# Altium schematic sheet [13] - ETHERNET PHY.SchDoc
size A2; DocumentNumber: 13; SheetNumber: 13; SheetTotal: 20
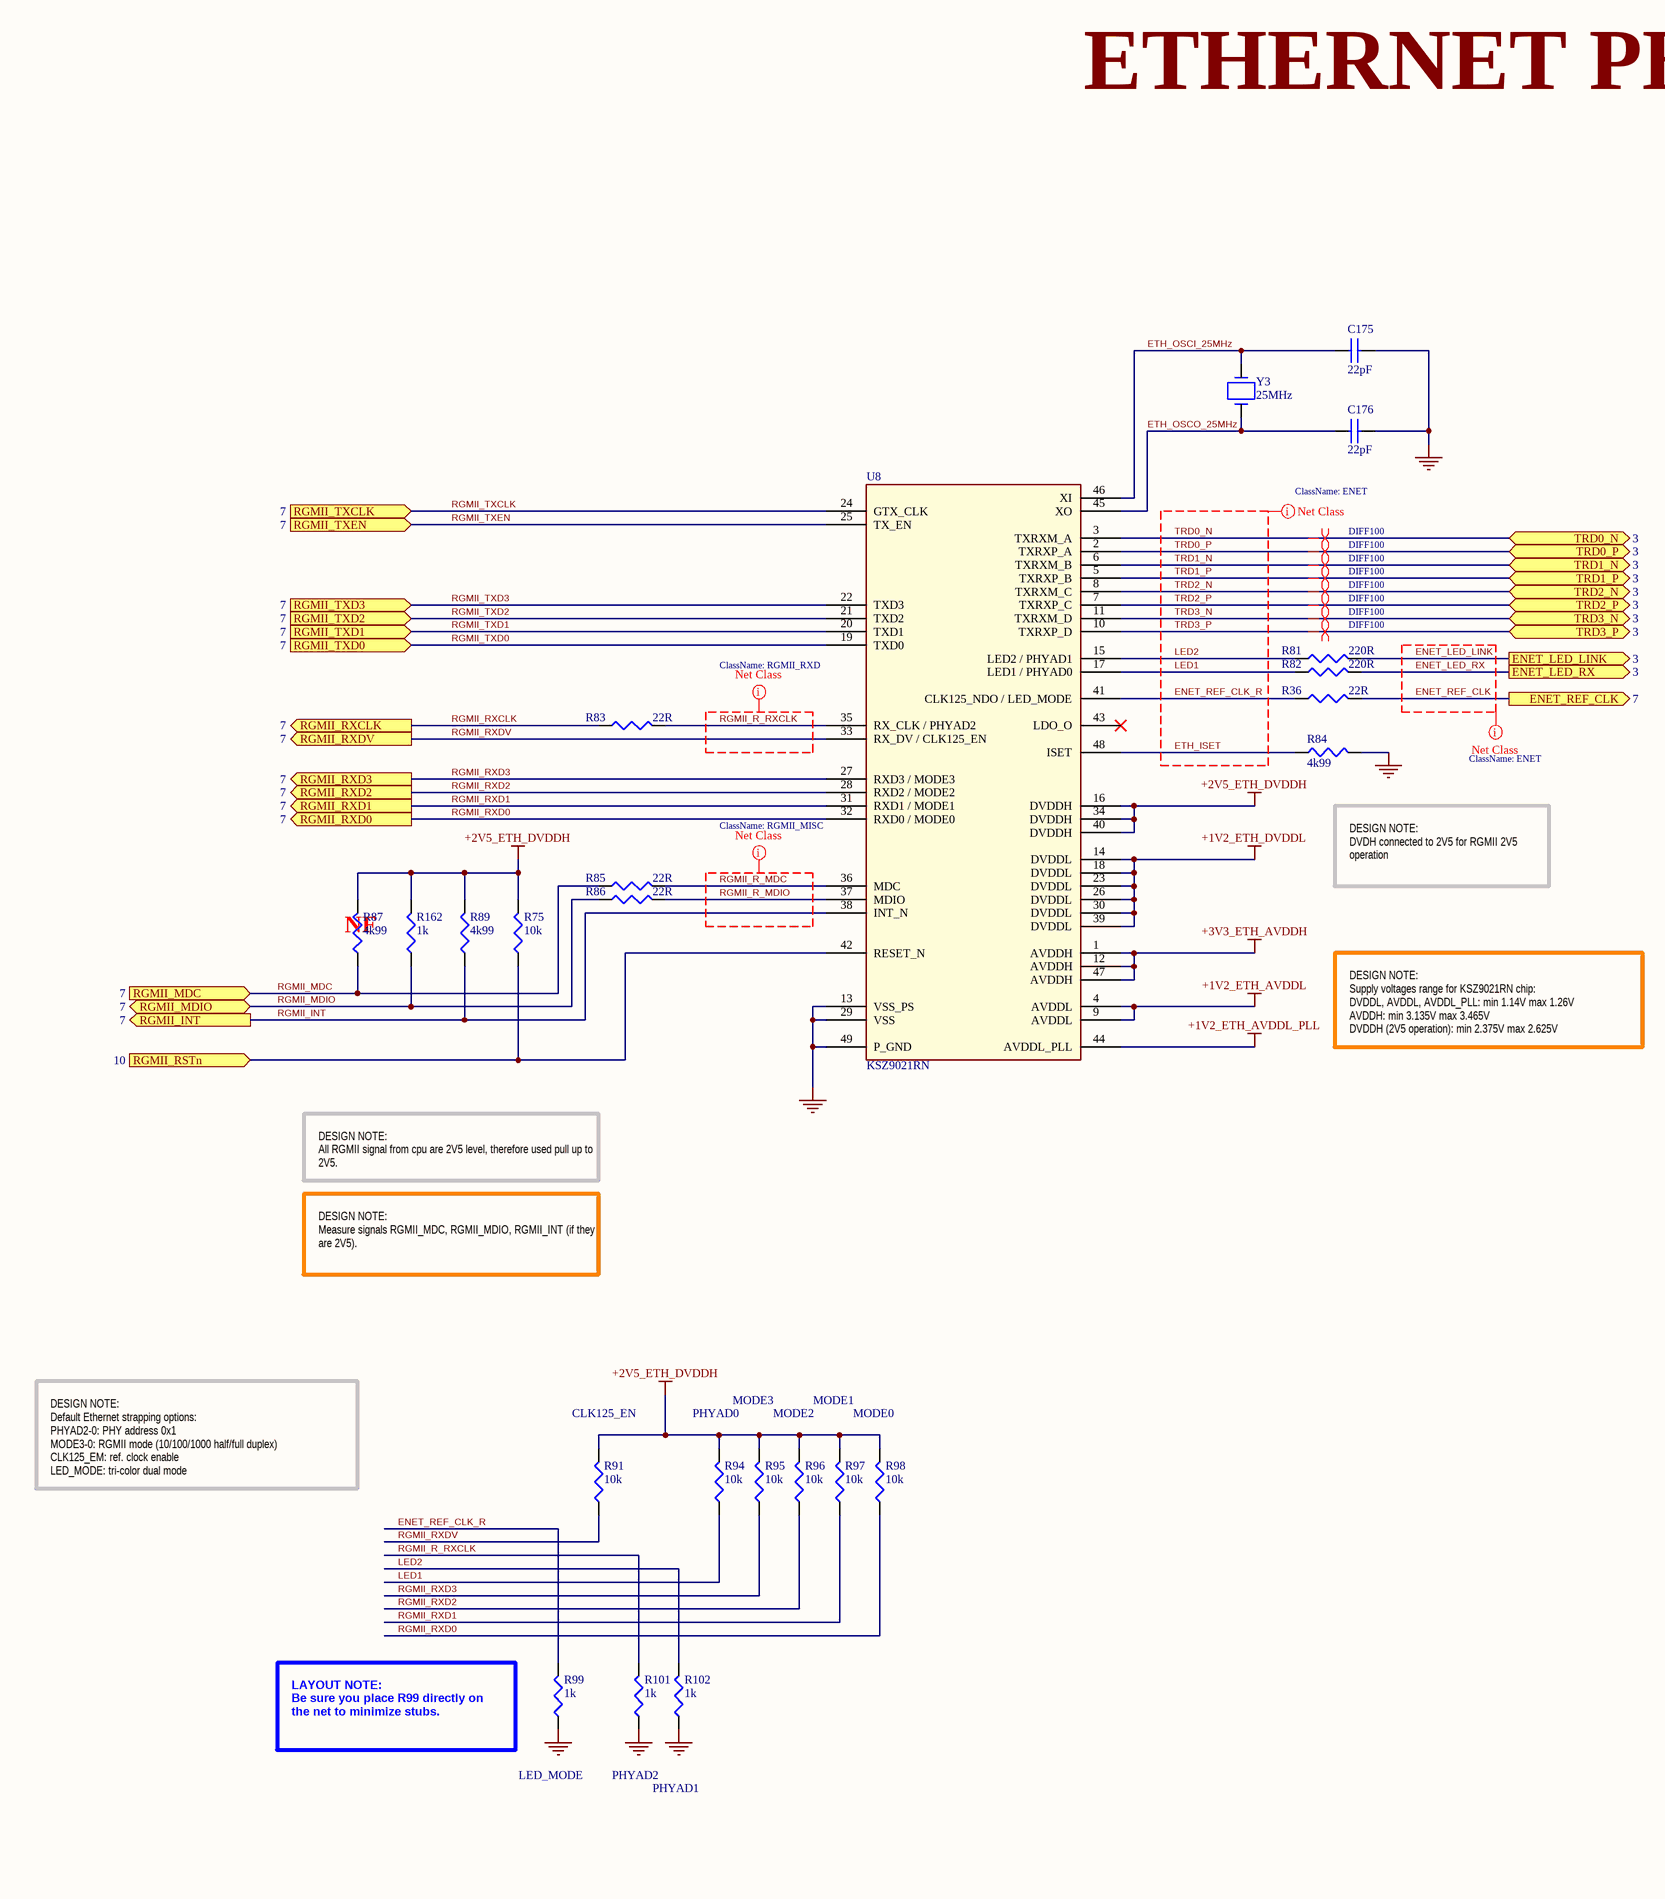
[diagram p0: [13] - ETHERNET PHY.SchDoc, left]
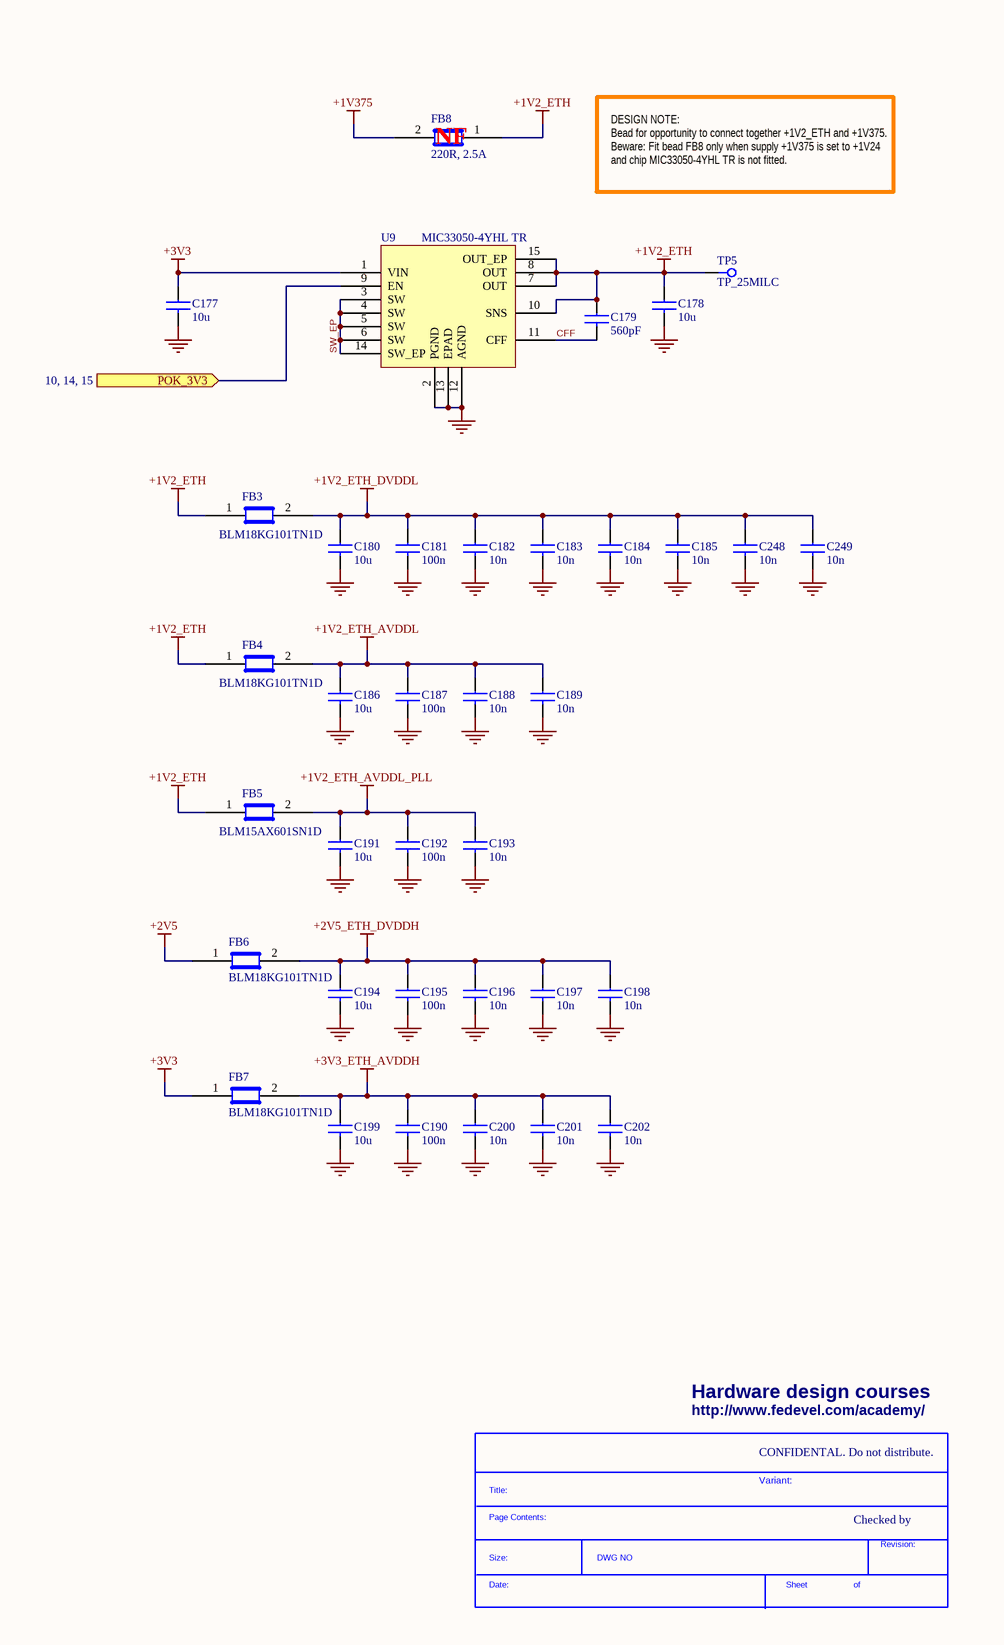
[diagram p1: [13] - ETHERNET PHY.SchDoc, right]

## Parts
*  SDTitleBlock  (value not drawn)  (graphical)
C175  22pF  [C0402]
C176  22pF  [C0402]
C177  10u  [C0603]
C178  10u  [C0603]
C179  560pF  [C0402]
C180  10u  [C0603]
C181  100n  [C0402]
C182  10n  [C0402]
C183  10n  [C0402]
C184  10n  [C0402]
C185  10n  [C0402]
C186  10u  [C0603]
C187  100n  [C0402]
C188  10n  [C0402]
C189  10n  [C0402]
C190  100n  [C0402]
C191  10u  [C0603]
C192  100n  [C0402]
C193  10n  [C0402]
C194  10u  [C0603]
C195  100n  [C0402]
C196  10n  [C0402]
C197  10n  [C0402]
C198  10n  [C0402]
C199  10u  [C0603]
C200  10n  [C0402]
C201  10n  [C0402]
C202  10n  [C0402]
C248  10n  [C0402]
C249  10n  [C0402]
FB3  BLM18KG101TN1D  [C0603]
FB4  BLM18KG101TN1D  [C0603]
FB5  BLM15AX601SN1D  [C0402]
FB6  BLM18KG101TN1D  [C0603]
FB7  BLM18KG101TN1D  [C0603]
FB8  220R, 2.5A  [C0603]
R36  22R  [R0402]
R75  10k  [R0402]
R81  220R  [R0402]
R82  220R  [R0402]
R83  22R  [R0402]
R84  4k99  [R0402]
R85  22R  [R0402]
R86  22R  [R0402]
R87  4k99  [R0402]
R89  4k99  [R0402]
R91  10k  [R0402]
R94  10k  [R0402]
R95  10k  [R0402]
R96  10k  [R0402]
R97  10k  [R0402]
R98  10k  [R0402]
R99  1k  [R0402]
R101  1k  [R0402]
R102  1k  [R0402]
R162  1k  [R0402]
TP5  TP_25MILC  [TP_25C]  (no BOM)
U8  KSZ9021RN  [QFN48_7MMX7MM]
U9  MIC33050-4YHL TR  [MLF_3x3_12PINS]
Y3  25MHz  [ABM7_v1_1]

## Ports
ENET_LED_LINK (out, see 3), ENET_LED_RX (out, see 3), ENET_REF_CLK (out, see 7), POK_3V3 (see 10, 14, 15), RGMII_INT (out, see 7), RGMII_MDC (in, see 7), RGMII_MDIO (bidir, see 7), RGMII_RSTn (in, see 10), RGMII_RXCLK (out, see 7), RGMII_RXD0 (out, see 7), RGMII_RXD1 (out, see 7), RGMII_RXD2 (out, see 7), RGMII_RXD3 (out, see 7), RGMII_RXDV (out, see 7), RGMII_TXCLK (in, see 7), RGMII_TXD0 (in, see 7), RGMII_TXD1 (in, see 7), RGMII_TXD2 (in, see 7), RGMII_TXD3 (in, see 7), RGMII_TXEN (in, see 7), TRD0_N (bidir, see 3), TRD0_P (bidir, see 3), TRD1_N (bidir, see 3), TRD1_P (bidir, see 3), TRD2_N (bidir, see 3), TRD2_P (bidir, see 3), TRD3_N (bidir, see 3), TRD3_P (bidir, see 3)

## Nets
+1V2_ETH: C178.1 C179.1 FB3.1 FB4.1 FB5.1 FB8.1 TP5.1 U9.7(OUT) U9.8(OUT) U9.10(SNS) U9.15(OUT_EP)
+1V2_ETH_AVDDL: C186.1 C187.1 C188.1 C189.1 FB4.2 U8.4(AVDDL) U8.9(AVDDL)
+1V2_ETH_AVDDL_PLL: C191.1 C192.1 C193.1 FB5.2 U8.44(AVDDL_PLL)
+1V2_ETH_DVDDL: C180.1 C181.1 C182.1 C183.1 C184.1 C185.1 C248.1 C249.1 FB3.2 U8.14(DVDDL) U8.18(DVDDL) U8.23(DVDDL) U8.26(DVDDL) U8.30(DVDDL) U8.39(DVDDL)
+1V375: FB8.2
+2V5: FB6.1
+2V5_ETH_DVDDH: C194.1 C195.1 C196.1 C197.1 C198.1 FB6.2 R75.2 R87.2 R89.2 R91.2 R94.2 R95.2 R96.2 R97.2 R98.2 R162.2 U8.16(DVDDH) U8.34(DVDDH) U8.40(DVDDH)
+3V3: C177.1 FB7.1 U9.1(VIN)
+3V3_ETH_AVDDH: C190.1 C199.1 C200.1 C201.1 C202.1 FB7.2 U8.1(AVDDH) U8.12(AVDDH) U8.47(AVDDH)
GND: C175.2 C176.2 C177.2 C178.2 C180.2 C181.2 C182.2 C183.2 C184.2 C185.2 C186.2 C187.2 C188.2 C189.2 C190.2 C191.2 C192.2 C193.2 C194.2 C195.2 C196.2 C197.2 C198.2 C199.2 C200.2 C201.2 C202.2 C248.2 C249.2 R84.2 R99.1 R101.1 R102.1 U8.13(VSS_PS) U8.29(VSS) U8.49(P_GND) U9.2(PGND) U9.12(AGND) U9.13(EPAD)
CFF: C179.2 U9.11(CFF)
ENET_LED_LINK: R81.2 ; port ENET_LED_LINK
ENET_LED_RX: R82.2 ; port ENET_LED_RX
ENET_REF_CLK: R36.2 ; port ENET_REF_CLK
ENET_REF_CLK_R: R36.1 R99.2 U8.41(CLK125_NDO_/_LED_MODE)
ETH_ISET: R84.1 U8.48(ISET)
ETH_OSCI_25MHz: C175.1 U8.46(XI) Y3.2
ETH_OSCO_25MHz: C176.1 U8.45(XO) Y3.1
LED1: R82.1 R94.1 U8.17(LED1_/_PHYAD0)
LED2: R81.1 R102.2 U8.15(LED2_/_PHYAD1)
POK_3V3: U9.9(EN) ; port POK_3V3
RGMII_INT: R89.1 U8.38(INT_N) ; port RGMII_INT
RGMII_MDC: R85.1 R87.1 ; port RGMII_MDC
RGMII_MDIO: R86.1 R162.1 ; port RGMII_MDIO
RGMII_R_MDC: R85.2 U8.36(MDC)
RGMII_R_MDIO: R86.2 U8.37(MDIO)
RGMII_R_RXCLK: R83.2 R101.2 U8.35(RX_CLK_/_PHYAD2)
RGMII_RSTn: R75.1 U8.42(RESET_N) ; port RGMII_RSTn
RGMII_RXCLK: R83.1 ; port RGMII_RXCLK
RGMII_RXD0: R98.1 U8.32(RXD0_/_MODE0) ; port RGMII_RXD0
RGMII_RXD1: R97.1 U8.31(RXD1_/_MODE1) ; port RGMII_RXD1
RGMII_RXD2: R96.1 U8.28(RXD2_/_MODE2) ; port RGMII_RXD2
RGMII_RXD3: R95.1 U8.27(RXD3_/_MODE3) ; port RGMII_RXD3
RGMII_RXDV: R91.1 U8.33(RX_DV_/_CLK125_EN) ; port RGMII_RXDV
RGMII_TXCLK: U8.24(GTX_CLK) ; port RGMII_TXCLK
RGMII_TXD0: U8.19(TXD0) ; port RGMII_TXD0
RGMII_TXD1: U8.20(TXD1) ; port RGMII_TXD1
RGMII_TXD2: U8.21(TXD2) ; port RGMII_TXD2
RGMII_TXD3: U8.22(TXD3) ; port RGMII_TXD3
RGMII_TXEN: U8.25(TX_EN) ; port RGMII_TXEN
SW_EP: U9.3(SW) U9.4(SW) U9.5(SW) U9.6(SW) U9.14(SW_EP)
TRD0_N: U8.3(TXRXM_A) ; port TRD0_N
TRD0_P: U8.2(TXRXP_A) ; port TRD0_P
TRD1_N: U8.6(TXRXM_B) ; port TRD1_N
TRD1_P: U8.5(TXRXP_B) ; port TRD1_P
TRD2_N: U8.8(TXRXM_C) ; port TRD2_N
TRD2_P: U8.7(TXRXP_C) ; port TRD2_P
TRD3_N: U8.11(TXRXM_D) ; port TRD3_N
TRD3_P: U8.10(TXRXP_D) ; port TRD3_P

Not connected (* = marked no-connect by the designer): U8 43(LDO_O)*

## Layout directives
differential pair; net class DIFF100: TRD0_N, TRD0_P, TRD1_N, TRD1_P, TRD2_N, TRD2_P, TRD3_N, TRD3_P
net class ENET: ENET_LED_LINK, ENET_LED_RX, ENET_REF_CLK, ENET_REF_CLK_R, ETH_ISET, LED1, LED2, TRD0_N, TRD0_P, TRD1_N, TRD1_P, TRD2_N, TRD2_P, TRD3_N, TRD3_P
net class RGMII_MISC: RGMII_R_MDC, RGMII_R_MDIO
net class RGMII_RXD: RGMII_R_RXCLK

## Notes on the sheet
- ETHERNET PHY
- (near FB8) NF
- DESIGN NOTE:
  Bead for opportunity to connect together +1V2_ETH and +1V375. Beware: Fit bead FB8 only when supply +1V375 is set to +1V24 and chip MIC33050-4YHL TR is not fitted.
- DESIGN NOTE:
  DVDH connected to 2V5 for RGMII 2V5 operation
- (near R87) NF
- DESIGN NOTE:
  Supply voltages range for KSZ9021RN chip:
  DVDDL, AVDDL, AVDDL_PLL: min 1.14V max 1.26V
  AVDDH: min 3.135V max 3.465V
  DVDDH (2V5 operation): min 2.375V max 2.625V
- DESIGN NOTE:
  All RGMII signal from cpu are 2V5 level, therefore used pull up to 2V5.
- DESIGN NOTE:
  Measure signals RGMII_MDC, RGMII_MDIO, RGMII_INT (if they are 2V5).
- (near R91) CLK125_EN
- PHYAD0
- MODE3
- MODE2
- MODE1
- MODE0
- DESIGN NOTE:
  Default Ethernet strapping options:
  PHYAD2-0: PHY address 0x1
  MODE3-0: RGMII mode (10/100/1000 half/full duplex)
  CLK125_EM: ref. clock enable
  LED_MODE: tri-color dual mode
- LAYOUT NOTE:
  Be sure you place R99 directly on the net to minimize stubs.
- LED_MODE
- PHYAD2
- Hardware design courses
- PHYAD1
- http://www.fedevel.com/academy/
- CONFIDENTAL. Do not distribute.
- Variant:
- Checked by
- (in symbol SDTitleBlock) Title:; Page Contents:; Revision:; Size:; DWG NO; Date:; Sheet; of

## Library data of the parts
C175 C176 = C1005C0G1H220J: CAP CER 22PF 50V C0G 5% 0402; Manufacturer: TDK Corporation; .Checked PCB: used; Description: CAP CER 22PF 50V 5% NP0 0402; Temperature Coefficient: C0G, NP0; Capacitance: 22pF; Category: Capacitors; Manufacturer Part Number: C1005C0G1H220J; Operating Temperature: -55°C ~ 125°C; Package / Case: 0402 (1005 Metric); Price 1k [$]: 0.00442; Value: 22pF; .Checked SCH: used; Voltage - Rated: 50V; Supplier Part Number: 445-1239-1-ND; Supplier: Digikey; Supplier 1: Digi-Key; Supplier Part Number 1: 445-1239-1-ND; RoHS: RoHS Compliant; Stock 1: 176261; Pricing 1: 1=0.08, 10=0.05, 100=0.018, 250=0.013, 500=0.0096, 1000=0.0065 (USD); Tolerance: ±5%; Mounting Type: Surface Mount, MLCC; Applications: General Purpose; Ratings: -; Size / Dimension: 0.039" L x 0.020" W (1.00mm x 0.50mm); Height - Seated (Max): -; Thickness (Max): 0.022" (0.55mm); Lead Spacing: -; Features: -; Packaging: Cut Tape (CT); Lead Style: -; ComponentLink1URL: http://www.tdk.co.jp/tefe02/e412_c.pdf; ComponentLink1Description: http://www.tdk.co.jp/tefe02/e412_c.pdf
C177 C178 C180 C186 C191 C194 C199 = C1608X5R0J106M: CAP CER 10UF 6.3V X5R 20% 0603; Manufacturer: TDK Corporation; Capacitance: 10µF; Value: 10µF; .Checked PCB: used; Description: CAP CER 10UF 6.3V 20% X5R 0603; Category: Capacitors; Manufacturer Part Number: C1608X5R0J106M; Operating Temperature: -55°C ~ 85°C; Package / Case: 0603 (1608 Metric); Price 1k [$]: 0.08580; .Checked SCH: used; Voltage - Rated: 6.3V; Features: Low ESR; Supplier Part Number: 445-4112-1-ND; Supplier: Digikey; Supplier 1: Digi-Key; Supplier Part Number 1: 445-4112-1-ND; RoHS: RoHS Compliant; Stock 1: 48157; Pricing 1: 1=0.46, 10=0.363, 100=0.1898, 250=0.14024, 500=0.1089, 1000=0.0858 (USD); Tolerance: ±20%; Temperature Coefficient: X5R; Mounting Type: Surface Mount, MLCC; Applications: General Purpose; Ratings: -; Size / Dimension: 0.063" L x 0.031" W (1.60mm x 0.80mm); Height - Seated (Max): -; Thickness (Max): 0.037" (0.95mm); Lead Spacing: -; Packaging: Cut Tape (CT); Lead Style: -; ComponentLink1URL: http://www.tdk.com/pdf/general_B11.pdf; ComponentLink1Description: http://www.tdk.com/pdf/general_B11.pdf
C179 = GRM1555C1H561JA01D: CAP CER 560PF 50V C0G 0402; Manufacturer: Murata Electronics North America; .Checked PCB: used; Description: CAP CER 560PF 50V 5% NP0 0402; Tolerance: ±5%; Temperature Coefficient: C0G, NP0; Capacitance: 560pF; Category: Capacitors; Supplier Part Number: 490-3238-1-ND; Manufacturer Part Number: GRM1555C1H561JA01D; Operating Temperature: -55°C ~ 125°C; Package / Case: 0402 (1005 Metric); Price 1k [$]: 0.0149; Value: 560pF; .Checked SCH: used; Voltage - Rated: 50V; Supplier: Digikey; Supplier 1: Digi-Key; Supplier Part Number 1: 490-3238-1-ND; RoHS: RoHS Compliant; Stock 1: 301161; Pricing 1: 10=0.066, 50=0.0528, 100=0.0396, 250=0.0286, 500=0.02112, 1000=0.0143, 5000=0.011 (USD); Mounting Type: Surface Mount, MLCC; Applications: General Purpose; Ratings: -; Size / Dimension: 0.039" L x 0.020" W (1.00mm x 0.50mm); Height - Seated (Max): -; Thickness (Max): 0.022" (0.55mm); Lead Spacing: -; Features: -; Packaging: Cut Tape (CT); Lead Style: -; ComponentLink1URL: http://search.murata.co.jp/Ceramy/image/img/PDF/ENG/GRM1555C1H561JA01.pdf; ComponentLink1Description: http://search.murata.co.jp/Ceramy/image/img/PDF/ENG/GRM1555C1H561JA01.pdf
C181 C187 C190 C192 C195 = C1005X5R1H104K: CAP CER .10UF 50V X5R 10% 0402; Manufacturer: TDK Corporation; Capacitance: 0.1µF; Value: 100nF; .Checked PCB: used; Description: CAP CER 0.1UF 50V 10% X5R 0402; Category: Capacitors; Manufacturer Part Number: C1005X5R1H104K; Operating Temperature: -55°C ~ 85°C; Package / Case: 0402 (1005 Metric); Price 1k [$]: 0.02340; .Checked SCH: used; Voltage - Rated: 50V; Supplier Part Number: 445-5942-1-ND; Supplier: Digikey; Supplier 1: Digi-Key; Supplier Part Number 1: 445-5942-1-ND; RoHS: RoHS Compliant; Stock 1: 106926; Pricing 1: 1=0.27, 10=0.18, 100=0.072, 250=0.05176, 500=0.0369, 1000=0.027 (USD); Tolerance: ±10%; Temperature Coefficient: X5R; Mounting Type: Surface Mount, MLCC; Applications: General Purpose; Ratings: -; Size / Dimension: 0.039" L x 0.020" W (1.00mm x 0.50mm); Height - Seated (Max): -; Thickness (Max): 0.022" (0.55mm); Lead Spacing: -; Features: -; Packaging: Cut Tape (CT); Lead Style: -; ComponentLink1URL: http://www.tdk.co.jp/tefe02/e412_c.pdf; ComponentLink1Description: http://www.tdk.co.jp/tefe02/e412_c.pdf
C182-C185 C188 C189 C193 C196-C198 C200-C202 C248 C249 = C1005X7R1C103K: CAP CER 10000PF 16V X7R 10% 0402; Manufacturer: TDK Corporation; Value: 10nF; .Checked PCB: used; Description: CAP CER 10000PF 16V 10% X7R 0402; Capacitance: 10000pF; Category: Capacitors; Manufacturer Part Number: C1005X7R1C103K; Operating Temperature: -55°C ~ 125°C; Package / Case: 0402 (1005 Metric); Price 1k [$]: 0.00416; .Checked SCH: used; Voltage - Rated: 16V; Supplier Part Number: 445-1262-1-ND; Supplier: Digikey; Supplier 1: Digi-Key; Supplier Part Number 1: 445-1262-1-ND; RoHS: RoHS Compliant; Stock 1: 511497; Pricing 1: 1=0.08, 10=0.05, 100=0.018, 250=0.013, 500=0.0096, 1000=0.0065 (USD); Tolerance: ±10%; Temperature Coefficient: X7R; Mounting Type: Surface Mount, MLCC; Applications: General Purpose; Ratings: -; Size / Dimension: 0.039" L x 0.020" W (1.00mm x 0.50mm); Height - Seated (Max): -; Thickness (Max): 0.022" (0.55mm); Lead Spacing: -; Features: -; Packaging: Cut Tape (CT); Lead Style: -; ComponentLink1URL: http://www.tdk.co.jp/tefe02/e412_c.pdf; ComponentLink1Description: http://www.tdk.co.jp/tefe02/e412_c.pdf
FB3 FB4 FB6 FB7 = BLM18KG101TN1D: FERRITE CHIP 100 OHM BEAD 0603 3A; Manufacturer: Murata Electronics North America; .Checked PCB: used; Impedance @ Frequency: 100 Ohm @ 100MHz; DC Resistance (DCR): 30 mOhm Max; Filter Type: Differential Mode - Single; Number of Lines: 1; .Checked SCH: used; Category: Filters; Manufacturer Part Number: BLM18KG101TN1D; Package / Case: 0603 (1608 Metric); Price 1k [$]: 0.04320; Value: BLM18KG101TN1D; Current Rating: 3A; Supplier Part Number: 490-5448-1-ND; Supplier: Digikey; Supplier 1: Digi-Key; Supplier Part Number 1: 490-5448-1-ND; RoHS: RoHS Compliant; Description: FERRITE CHIP 100 OHM BEAD 0603; Stock 1: 10314; Pricing 1: 1=0.35, 10=0.23, 50=0.1196, 100=0.0922, 250=0.06624, 500=0.04724, 1000=0.03456 (USD); Mounting Type: Surface Mount; Packaging: Cut Tape (CT); Height (Max): 0.030" (0.75mm); Size / Dimension: 0.063" L x 0.031" W (1.60mm x 0.80mm); ComponentLink1URL: http://search.murata.co.jp/Ceramy/image/img/PDF/ENG/L0110S0100BLM18K.pdf; ComponentLink1Description: http://search.murata.co.jp/Ceramy/image/img/PDF/ENG/L0110S0100BLM18K.pdf
FB5 = BLM15AX601SN1D: FERRITE CHIP 600 OHM 0402 420mA; Manufacturer: Murata Electronics North America; .Checked PCB: used; Impedance @ Frequency: 600 Ohm @ 100MHz; DC Resistance (DCR): 340 mOhm Max; Filter Type: Differential Mode - Single; Number of Lines: 1; .Checked SCH: used; Category: Filters; Manufacturer Part Number: BLM15AX601SN1D; Package / Case: 0402 (1005 Metric); Price 1k [$]: 0.03280; Value: BLM15AX601SN1D; Current Rating: 420mA; Supplier Part Number: 490-5441-1-ND; Supplier: Digikey; Supplier 1: Digi-Key; Supplier Part Number 1: 490-5441-1-ND; RoHS: RoHS Compliant; Description: FERRITE CHIP 600 OHM 0402; Stock 1: 34008; Pricing 1: 1=0.26, 10=0.197, 50=0.1148, 100=0.0918, 250=0.0656, 500=0.0446, 1000=0.03608, 5000=0.02821 (USD); Mounting Type: Surface Mount; Packaging: Cut Tape (CT); Height (Max): 0.022" (0.55mm); Size / Dimension: 0.039" L x 0.020" W (1.00mm x 0.50mm); ComponentLink1URL: http://search.murata.co.jp/Ceramy/image/img/PDF/ENG/L0110S0100BLM15AX_SN.pdf; ComponentLink1Description: http://search.murata.co.jp/Ceramy/image/img/PDF/ENG/L0110S0100BLM15AX_SN.pdf
FB8 = BLM18SG221TN1D: FERRITE CHIP 220 OHM 2500MA 0603; Manufacturer: Murata Electronics North America; Impedance @ Frequency: 220 Ohm @ 100MHz; DC Resistance (DCR): 40 mOhm Max; Filter Type: Differential Mode - Single; Number of Lines: 1; .Checked PCB: RF; Supplier 1: Digi-Key; Supplier Part Number 1: 490-5225-1-ND; Manufacturer Part Number: BLM18SG221TN1D; RoHS: RoHS Compliant; Category: Filters; Stock 1: 54640; Pricing 1: 1=0.38, 10=0.282, 50=0.1646, 100=0.1316, 250=0.094, 500=0.06392, 1000=0.0517, 5000=0.04042 (USD); Current Rating: 2.5A; Package / Case: 0603 (1608 Metric); Mounting Type: Surface Mount; Packaging: Cut Tape (CT); Height (Max): 0.037" (0.95mm); Size / Dimension: 0.063" L x 0.031" W (1.60mm x 0.80mm); ComponentLink1URL: http://search.murata.co.jp/Ceramy/image/img/PDF/ENG/L0110S0100BLM18S.pdf; ComponentLink1Description: http://search.murata.co.jp/Ceramy/image/img/PDF/ENG/L0110S0100BLM18S.pdf; .Checked SCH: RF
R36 R83 R85 R86 = RC0402FR-0722RL: RES 22.0 OHM 1/16W 1% 0402 SMD; Manufacturer: Yageo; Resistance (Ohms): 22; Power (Watts): 0.063W, 1/16W; .Checked PCB: used; Temperature Coefficient: ±100ppm/°C; Category: Resistors; Manufacturer Part Number: RC0402FR-0722RL; Package / Case: 0402 (1005 Metric); Price 1k [$]: 0.01421; Tolerance: ±1%; Value: 22R; .Checked SCH: used; Supplier Part Number: 311-22.0LRCT-ND; Supplier: Digikey; Supplier 1: Digi-Key; Supplier Part Number 1: 311-22.0LRCT-ND; RoHS: RoHS Compliant; Stock 1: 943800; Pricing 1: 10=0.014, 50=0.0104, 100=0.0079, 250=0.00584, 500=0.00432, 1000=0.00288 (USD); Composition: Thick Film; Features: -; Size / Dimension: 0.039" L x 0.020" W (1.00mm x 0.50mm); Height: 0.016" (0.40mm); Number of Terminations: 2; Packaging: Cut Tape (CT); ComponentLink1URL: http://www.yageo.com/documents/recent/PYu-RC0402_51_RoHS_L_6.pdf; ComponentLink1Description: http://www.yageo.com/documents/recent/PYu-RC0402_51_RoHS_L_6.pdf
R75 R91 R94-R98 = RC0402FR-0710KL: RES 10.0K OHM 1/16W 1% 0402 SMD; Manufacturer: Yageo; Power (Watts): 0.063W, 1/16W; .Checked PCB: used; Temperature Coefficient: ±100ppm/°C; Category: Resistors; Supplier Part Number: 311-10.0KLRCT-ND; Manufacturer Part Number: RC0402FR-0710KL; Package / Case: 0402 (1005 Metric); Price 1k [$]: 0.01421; Resistance (Ohms): 10K; Tolerance: ±1%; Value: 10k; .Checked SCH: used; Supplier: Digikey; Supplier 1: Digi-Key; Supplier Part Number 1: 311-10.0KLRCT-ND; RoHS: RoHS Compliant; Stock 1: 2916495; Pricing 1: 10=0.014, 50=0.0104, 100=0.0079, 250=0.00584, 500=0.00432, 1000=0.00288 (USD); Composition: Thick Film; Features: -; Size / Dimension: 0.039" L x 0.020" W (1.00mm x 0.50mm); Height: 0.016" (0.40mm); Number of Terminations: 2; Packaging: Cut Tape (CT); ComponentLink1URL: http://www.yageo.com/documents/recent/PYu-RC0402_51_RoHS_L_6.pdf; ComponentLink1Description: http://www.yageo.com/documents/recent/PYu-RC0402_51_RoHS_L_6.pdf
R81 R82 = RC0402FR-07220RL: RES 220 OHM 1/16W 1% 0402 SMD; Manufacturer: Yageo; Resistance (Ohms): 220; Power (Watts): 0.063W, 1/16W; .Checked PCB: used; Temperature Coefficient: ±100ppm/°C; Category: Resistors; Manufacturer Part Number: RC0402FR-07220RL; Package / Case: 0402 (1005 Metric); Price 1k [$]: 0.01421; Tolerance: ±1%; Value: 220R; .Checked SCH: used; Supplier Part Number: 311-220LRCT-ND; Supplier: Digikey; Supplier 1: Digi-Key; Supplier Part Number 1: 311-220LRCT-ND; RoHS: RoHS Compliant; Stock 1: 276463; Pricing 1: 10=0.014, 50=0.0104, 100=0.0079, 250=0.00584, 500=0.00432, 1000=0.00288 (USD); Composition: Thick Film; Features: -; Size / Dimension: 0.039" L x 0.020" W (1.00mm x 0.50mm); Height: 0.016" (0.40mm); Number of Terminations: 2; Packaging: Cut Tape (CT); ComponentLink1URL: http://www.yageo.com/documents/recent/PYu-RC0402_51_RoHS_L_6.pdf; ComponentLink1Description: http://www.yageo.com/documents/recent/PYu-RC0402_51_RoHS_L_6.pdf
R84 R87 R89 = RMCF0402FT4K99: RES TF 4.99K OHM 1% 1/16W 0402; Manufacturer: Stackpole Electronics Inc; Power (Watts): 0.063W, 1/16W; .Checked PCB: used; Temperature Coefficient: ±100ppm/°C; Category: Resistors; Manufacturer Part Number: RMCF0402FT4K99; Package / Case: 0402 (1005 Metric); Price 1k [$]: 0.00384; Resistance (Ohms): 4.99K; Tolerance: ±1%; Value: 4k99; .Checked SCH: used; Supplier Part Number: RMCF0402FT4K99CT-ND; Supplier: Digikey; Supplier 1: Digi-Key; Supplier Part Number 1: RMCF0402FT4K99CT-ND; RoHS: RoHS Compliant; Stock 1: 48509; Pricing 1: 1=0.04, 10=0.025, 50=0.0138, 100=0.0105, 250=0.0078, 500=0.00576, 1000=0.00384 (USD); Composition: Thick Film; Features: -; Size / Dimension: 0.039" L x 0.020" W (1.00mm x 0.50mm); Height: 0.016" (0.40mm); Number of Terminations: 2; Packaging: Cut Tape (CT); ComponentLink1URL: http://www.seielect.com/Catalog/SEI-RMCF.pdf; ComponentLink1Description: http://www.seielect.com/Catalog/SEI-RMCF.pdf
R99 R101 R102 R162 = RC0402FR-071KL: RES 1.00K OHM 1/16W 1% 0402 SMD; Manufacturer: Yageo; Power (Watts): 0.063W, 1/16W; .Checked PCB: used; Temperature Coefficient: ±100ppm/°C; Category: Resistors; Manufacturer Part Number: RC0402FR-071KL; Package / Case: 0402 (1005 Metric); Price 1k [$]: 0.01421; Resistance (Ohms): 1K; Tolerance: ±1%; Value: 1k; .Checked SCH: used; Supplier Part Number: 311-1.00KLRCT-ND; Supplier: Digikey; Supplier 1: Digi-Key; Supplier Part Number 1: 311-1.00KLRCT-ND; RoHS: RoHS Compliant; Stock 1: 1753477; Pricing 1: 10=0.014, 50=0.0104, 100=0.0079, 250=0.00584, 500=0.00432, 1000=0.00288 (USD); Composition: Thick Film; Features: -; Size / Dimension: 0.039" L x 0.020" W (1.00mm x 0.50mm); Height: 0.016" (0.40mm); Number of Terminations: 2; Packaging: Cut Tape (CT); ComponentLink1URL: http://www.yageo.com/documents/recent/PYu-RC0402_51_RoHS_L_6.pdf; ComponentLink1Description: http://www.yageo.com/documents/recent/PYu-RC0402_51_RoHS_L_6.pdf
TP5 = TP_25MILC: Test Point 25mil
U8 = KSZ9021RN: IC TXRX 10/100/1000 SGL 48QFN; Manufacturer: Micrel Inc; Number of Drivers/Receivers: 8/8; Protocol: Gigabit Ethernet; Voltage - Supply: 3.135 V ~ 3.465 V; .Creator: MM; .Checked PCB: MM, checked by RF; Supplier 1: Digi-Key; Manufacturer Part Number: KSZ9021RN; RoHS: RoHS Compliant; Category: Integrated Circuits (ICs); Stock 1: 909; Pricing 1: 1=6.85, 10=6.165, 50=5.617, 100=5.069, 250=4.658, 500=4.247, 1000=3.699, 2500=3.562, 5000=3.425 (USD); Type: Transceiver; Mounting Type: Surface Mount; Package / Case: 48-VFQFN Exposed Pad; Supplier Device Package: 48-QFN (7x7); Packaging: Tray; ComponentLink1URL: http://www.micrel.com/_PDF/Ethernet/datasheets/ksz9021rl-rn_ds.pdf; ComponentLink1Description: http://www.micrel.com/_PDF/Ethernet/datasheets/ksz9021rl-rn_ds.pdf; Supplier Part Number 1: 576-3637-ND; .Checked SCH: MM, checked by RF
U9 = MIC33050-4YHL TR: IC PWM REG 600mA 1.2V 12-MLF; Manufacturer: Micrel Inc; .Checked PCB: used; Voltage - Input: 2.7 V ~ 5.5 V; Description: IC BUCK SYNC 1.2V 0.6A 12MLF; Output Type: Fixed; Number of Outputs: 1; PWM Type: Current Mode; Frequency - Switching: 4MHz; Synchronous Rectifier: Yes; .Checked SCH: used; Category: Integrated Circuits (ICs); Supplier Part Number: 576-3044-1-ND; Family: PMIC - Voltage Regulators - Switching DC DC Converters & Controllers; Manufacturer Part Number: MIC33050-4YHL TR; Operating Temperature: -40°C ~ 125°C; Package / Case: 12-MLF®, QFN; Price 1k [$]: 1.62500; Value: MIC33050-4YHL TR; Voltage - Output: 1.2V; Current - Output: 600mA; Supplier: Digikey; Supplier 1: Digi-Key; Supplier Part Number 1: 576-3044-1-ND; RoHS: RoHS Compliant; Stock 1: 1750; Pricing 1: 1=2.34, 25=1.872, 100=1.456, 250=1.3832, 500=1.352 (USD); Type: Step-Down (Buck); Mounting Type: Surface Mount; Packaging: Cut Tape (CT); Supplier Device Package: 12-MLF™ (3x3); ComponentLink1URL: http://www.micrel.com/_PDF/mic33050.pdf; ComponentLink1Description: http://www.micrel.com/_PDF/mic33050.pdf
Y3 = ABM7-25.000MHZ-D-2-Y-T V1.1: CRYSTAL 25.0000 MHZ 18PF SMD; Manufacturer: Abracon Corporation; .Checked PCB: RF used by MM; Frequency Stability: ±30ppm; Frequency Tolerance: ±20ppm; Operating Mode: Fundamental; .V1.1: footprint & comment updated; .Checked SCH: RF used by MM; Category: Crystals and Oscillators; Supplier Part Number: 535-9847-1-ND; Manufacturer Part Number: ABM7-25.000MHZ-D-2-Y-T; Operating Temperature: -40°C ~ 85°C; Package / Case: 2-SMD, No Lead (DFN, LCC); Price 1k [$]: 0.66500; Value: 25MHz; Frequency: 25MHz; Load Capacitance: 18pF; Supplier: Digikey; Supplier 1: Digi-Key; Supplier Part Number 1: 535-9847-1-ND; RoHS: RoHS Compliant; Stock 1: 51752; Pricing 1: 1=1.31, 10=1.138, 50=0.9976, 100=0.7875, 500=0.665 (USD); Type: MHz Crystal; Mounting Type: Surface Mount; Size / Dimension: 0.236" L x 0.138" W (6.00mm x 3.50mm); Height: 0.055" (1.40mm); Packaging: Cut Tape (CT); ComponentLink1URL: http://www.abracon.com/Resonators/abm7.pdf; ComponentLink1Description: http://www.abracon.com/Resonators/abm7.pdf